# EAGLE design HG-Badge6 (EAGLE 8.2.0)
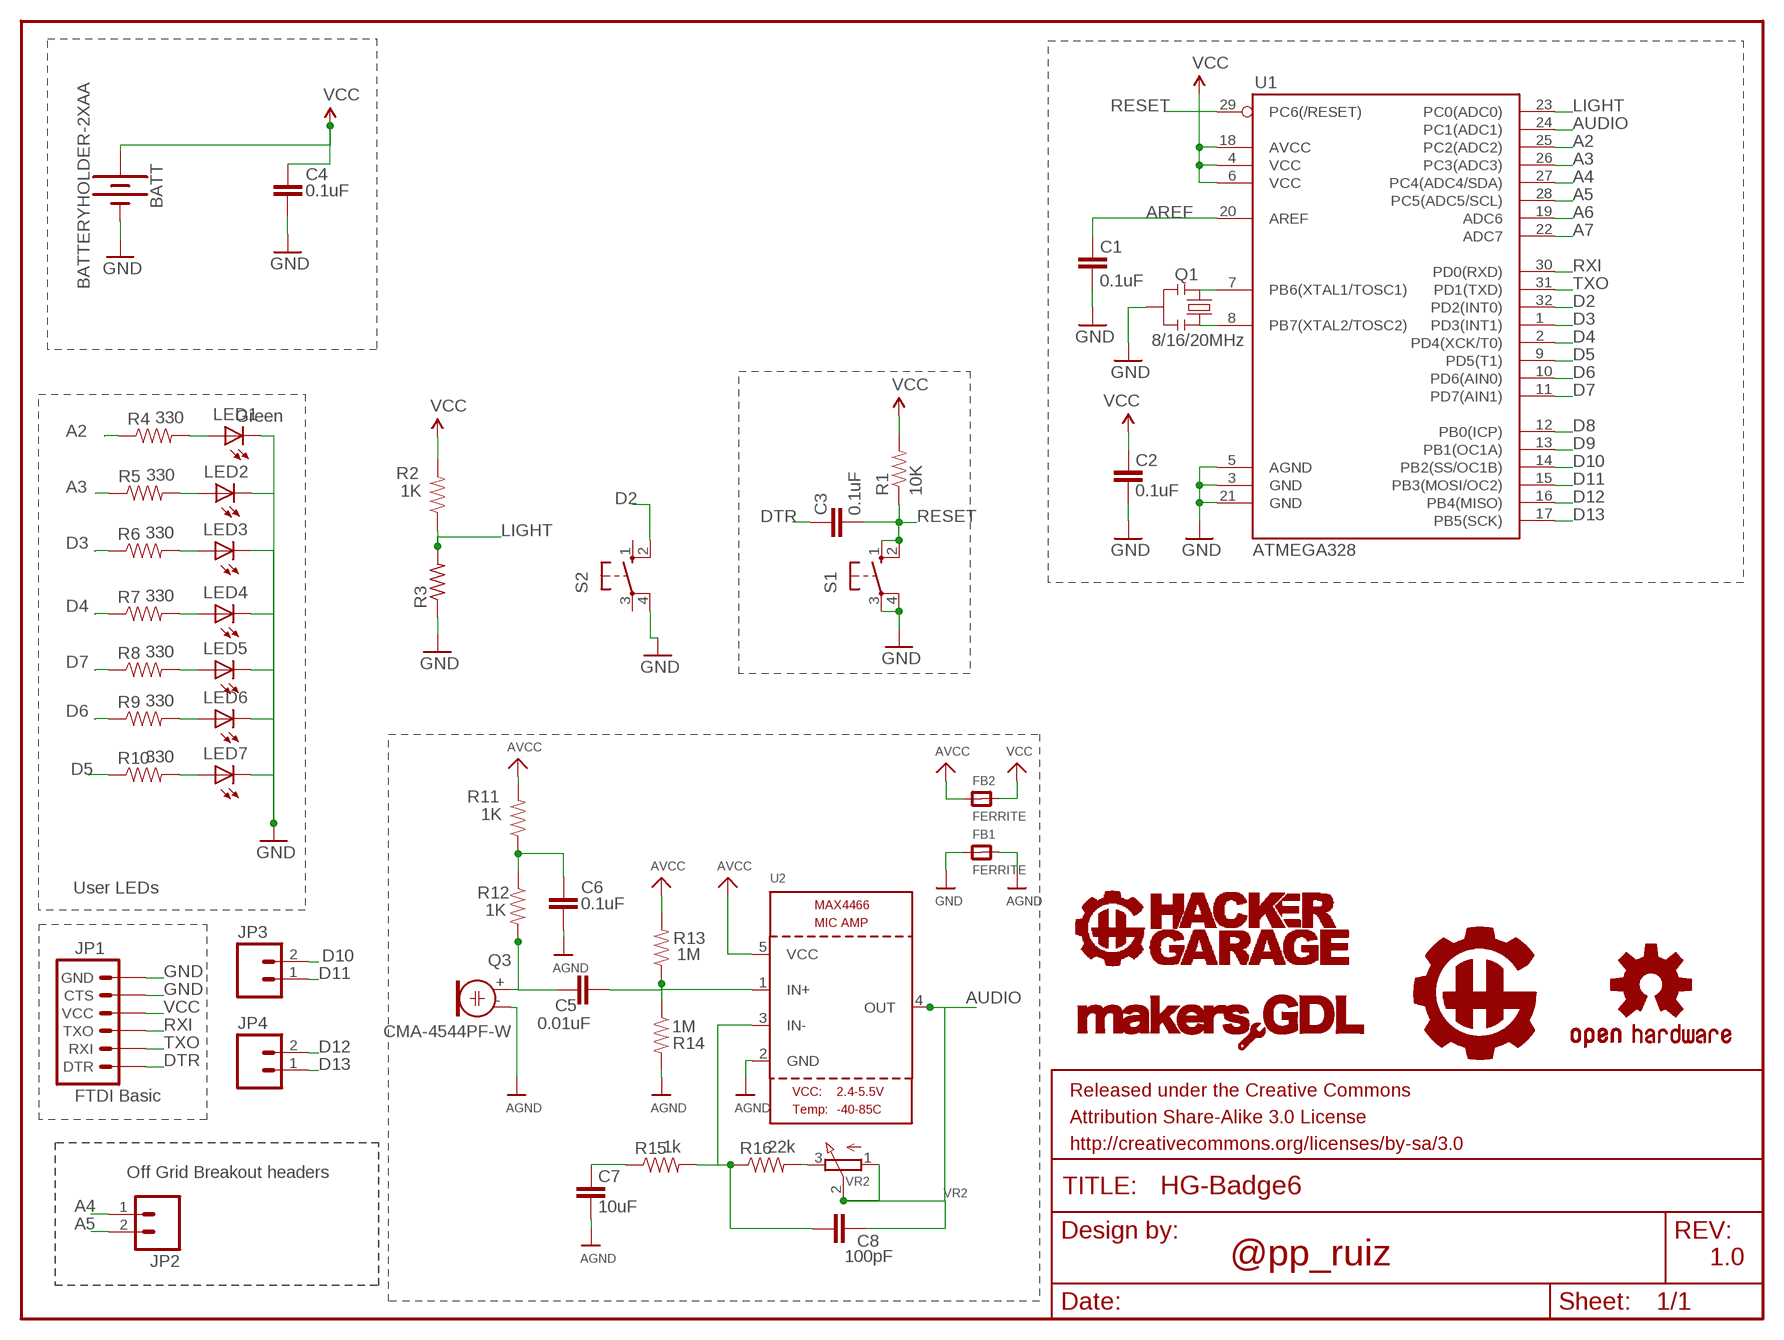
[diagram p0: schematic, sheet 1]

## Parts
BATT  BATTERYHOLDER-2XAA  [BATT-HOLDER-2XAAA]
C1  0.1uF  CAP0603-CAP  [0603-CAP]
C2  0.1uF  CAP0603-CAP  [0603-CAP]
C3  0.1uF  CAP0603-CAP  [0603-CAP]
C4  0.1uF  CAP0603-CAP  [0603-CAP]
C5  0.01uF  CAP0603-CAP  [0603-CAP]
C6  0.1uF  CAP0603-CAP  [0603-CAP]
C7  10uF  CAP0603-CAP  [0603-CAP]
C8  100pF  CAP0603-CAP  [0603-CAP]
FB1  FERRITE  FERRITE0805  [0805]
FB2  FERRITE  FERRITE0805  [0805]
FRAME1  FRAME-LETTER  [CREATIVE_COMMONS]
JP1  FTDI Basic  ARDUINO_SERIAL_PROGRAMPTH  [1X06]
JP2  M02PTH  [1X02]
JP3  M02PTH  [1X02]
JP4  M02PTH  [1X02]
LED1  Green  LED  [0603-LED-ALT1]
LED2  Green  LED  [0603-LED-ALT1]
LED3  Green  LED  [0603-LED-ALT1]
LED4  Green  LED  [0603-LED-ALT1]
LED5  Green  LED  [0603-LED-ALT1]
LED6  Green  LED  [0603-LED-ALT1]
LED7  Green  LED  [0603-LED-ALT1]
Q1  8/16/20MHz  RESONATOR1:1  [RESONATOR-SMD-1:1]
Q3  CMA-4544PF-W  ELECTRET  [ELECTRET_9.7]
R1  10K  RESISTOR0603-RES  [0603-RES]
R2  1K  RESISTOR0603-RES  [0603-RES]
R3  R-US_0204/2V  [0204V]
R4  330  RESISTOR0603-RES  [0603-RES]
R5  330  RESISTOR0603-RES  [0603-RES]
R6  330  RESISTOR0603-RES  [0603-RES]
R7  330  RESISTOR0603-RES  [0603-RES]
R8  330  RESISTOR0603-RES  [0603-RES]
R9  330  RESISTOR0603-RES  [0603-RES]
R10  330  RESISTOR0603-RES  [0603-RES]
R11  1K  RESISTOR0603-RES  [0603-RES]
R12  1K  RESISTOR0603-RES  [0603-RES]
R13  1M  RESISTOR0603-RES  [0603-RES]
R14  1M  RESISTOR0603-RES  [0603-RES]
R15  1k  RESISTOR0603-RES  [0603-RES]
R16  22k  RESISTOR0603-RES  [0603-RES]
S1  10-XX  [B3F-10XX]
S2  10-XX  [B3F-10XX]
U1  ATMEGA328  ATMEGA168  [TQFP32-08]
U2  MAX4466EXK+T  MAX4466""  [SC70-5]
U$1  HG-BADGE-FULL  [HG-BADGE]
U$3  OSHW-LOGOS  [OSHW-LOGO-S]
U$4  MAKERSGDLLOGO-SMALL  [MAKERSGGL-SMALL]
U$5  HACKERGARAGEFULL  [HACKERGARAGEFULL-SMALL]
VR2  VR2  TRIMPOTTC33X-2  [TRIMPOT_BOURNS_TC33X-2]

## Nets
A2: R4.1 U1.25(PC2(ADC2))
A3: R5.1 U1.26(PC3(ADC3))
A4: JP2.1 U1.27(PC4(ADC4/SDA))
A5: JP2.2 U1.28(PC5(ADC5/SCL))
A6: U1.19(ADC6)
A7: U1.22(ADC7)
AGND: C6.1 C7.1 FB1.2 Q3.- R14.2 U2.2(GND)
AREF: C1.2 U1.20(AREF)
AUDIO: C8.1 U1.24(PC1(ADC1)) U2.4(OUT) VR2.1(A) VR2.2(S)
AVCC: FB2.1 R11.2 R13.2 U2.5(VCC)
D2: S2.2(S1) U1.32(PD2(INT0))
D3: R6.1 U1.1(PD3(INT1))
D4: R7.1 U1.2(PD4(XCK/T0))
D5: R10.1 U1.9(PD5(T1))
D6: R9.1 U1.10(PD6(AIN0))
D7: R8.1 U1.11(PD7(AIN1))
D8: U1.12(PB0(ICP))
D9: U1.13(PB1(OC1A))
D10: JP3.2 U1.14(PB2(SS/OC1B))
D11: JP3.1 U1.15(PB3(MOSI/OC2))
D12: JP4.2 U1.16(PB4(MISO))
D13: JP4.1 U1.17(PB5(SCK))
DTR: C3.2 JP1.1(DTR)
GND: BATT.P$1(-) C1.1 C2.1 C4.1 FB1.1 JP1.5(CTS) JP1.6(GND) LED1.C LED2.C LED3.C LED4.C LED5.C LED6.C LED7.C Q1.2 R3.1 S1.3(P) S1.4(P1) S2.4(P1) U1.3(GND) U1.5(AGND) U1.21(GND)
LIGHT: R2.1 R3.2 U1.23(PC0(ADC0))
N$1: Q1.3 U1.8(PB7(XTAL2/TOSC2))
N$2: Q1.1 U1.7(PB6(XTAL1/TOSC1))
N$5: LED4.A R7.2
N$8: LED5.A R8.2
N$10: LED6.A R9.2
N$12: LED7.A R10.2
N$14: LED3.A R6.2
N$16: LED2.A R5.2
N$18: LED1.A R4.2
N$20: C8.2 R15.2 R16.1 U2.3(IN-)
N$21: C5.2 Q3.+ R12.2
N$22: C6.2 R11.1 R12.1
N$23: C5.1 R13.1 R14.1 U2.1(IN+)
N$24: R16.2 VR2.3(E)
N$25: C7.2 R15.1
RESET: C3.1 R1.1 S1.1(S) S1.2(S1) U1.29(PC6(/RESET))
RXI: JP1.3(TXO) U1.30(PD0(RXD))
TXO: JP1.2(RXI) U1.31(PD1(TXD))
VCC: BATT.P$2(+) C2.2 C4.2 FB2.2 JP1.4(VCC) R1.2 R2.2 U1.4(VCC) U1.6(VCC) U1.18(AVCC)
Unconnected: S2.1(S) S2.3(P)

## Notes on the sheet
- User LEDs
- Off Grid Breakout headers
- @pp_ruiz | 1.0

## Library data of the parts
BATT = StarlightMX:BATTERYHOLDER-2XAA
C1-C8 = SparkFun:CAP: Capacitor Standard 0603 ceramic capacitor, and 0.1" leaded capacitor.
FB1 FB2 = microbuilder:FERRITE: Ferrite Bead 0603 MMZ1608B121C - 120 Ohm @ 100MHz, 600mA, 0.15 Ohm DC Resistance - Digikey: 445-2164-1-ND BK1608HW121-T - 120 Ohm, 600mA Ferrite Chip - Digikey: 587-1876-2-ND 0805 HZ0805B272R-10 - 2.7K Ohm @ 100MHz, 200mA, 0.8 Ohm DC Resistance - Digikey: 240-2504-1-ND (see also Murata BLM21BD272SN1L) MMZ2012Y152B - 1.5K Ohm @ 100MHz, 500mA, 0.4 Ohm DC Resistance - Digikey: 445-1560-1-ND - Mainly for high frequency (80-400MHz) MMZ2012R102A - 1K Ohm @ 100MHz, 500mA, 0.3 Ohm DC Resistance - Digikey: 445-1555-2-ND - More general purpose (10-200MHz)
FRAME1 = SparkFun-Aesthetics:FRAME-LETTER: Schematic Frame Standard 8.5x11 US Letter frame
JP1 = SparkFun:ARDUINO_SERIAL_PROGRAM
JP2-JP4 = SparkFun:M02: Header 2 Standard 2-pin 0.1" header. Use with straight break away headers (SKU : PRT-00116), right angle break away headers (PRT-00553), swiss pins (PRT-00743), machine pins (PRT-00117), and female headers (PRT-00115). Molex polarized connector foot print use with SKU : PRT-08233 with associated crimp pins and housings.
LED1-LED7 = Testing:LED: LEDs Standard schematic elements and footprints for 5mm, 3mm, 1206, and 0603 sized LEDs. 5mm - Spark Fun Electronics SKU : COM-00529 (and others)
Q1 = Testing:RESONATOR: Resonator Small SMD resonator. This is the itty bitty 10/20MHz resonators with built in caps. CSTCE10M0G55 and CSTCE20M0V53. Footprint for SMD has been used in SFE production for years, and does work okay. 1:1 is an attempt to get larger fillets on the sides so it will be easier to inspect these solders in our AOI machine. The pads have been minimized to match the actual metal under the resonator. To see this relation, it includes an image import of the bottom side of the component. Imported to scale on layer 200.
Q3 = microbuilder:ELECTRET: Electret microphone Thru hole 2.54mm spacing with 9.7mm diameter
R1 R2 R4-R16 = SparkFun:RESISTOR: Resistor Basic schematic elements and footprints for 0603, 1206, and PTH resistors.
R3 = adafruit:R-US_: RESISTOR, American symbol
S1 S2 = switch-omron:10-XX: OMRON SWITCH; MPN: B3F-1000; OC_FARNELL: 176432; OC_NEWARK: 36M3542
U1 = SparkFun:ATMEGA168
U2 = microbuilder:MAX4466: MAX4466 - Microphone Pre-Amp
U$1 = StarlightMX:HG-BADGE-FULL
U$3 = SparkFun:OSHW-LOGO: Open Source Hardware Logo This logo indicates the piece of hardware it is found on incorporates a OSHW license and/or adheres to the definition of open source hardware found here: http://freedomdefined.org/OSHW
U$4 = StarlightMX:MAKERSGDLLOGO-SMALL
U$5 = StarlightMX:HACKERGARAGEFULL
VR2 = microbuilder:TRIMPOT: 3-Pin SMT Trimpots Bourns TC33 (X-2) Series 10K - Digikey: TC33X-2-103E 100K - Digikey: TC33X-104ECT-ND Bourns 3303 (W) Series 3mm 10K Single Turn - Digikey: 3303W-103ETR-ND 3mm 100K Single Turn - Digikey: 3303X-104ETR-ND

## Net classes
1 vcc: width 0.254 mm

## Board
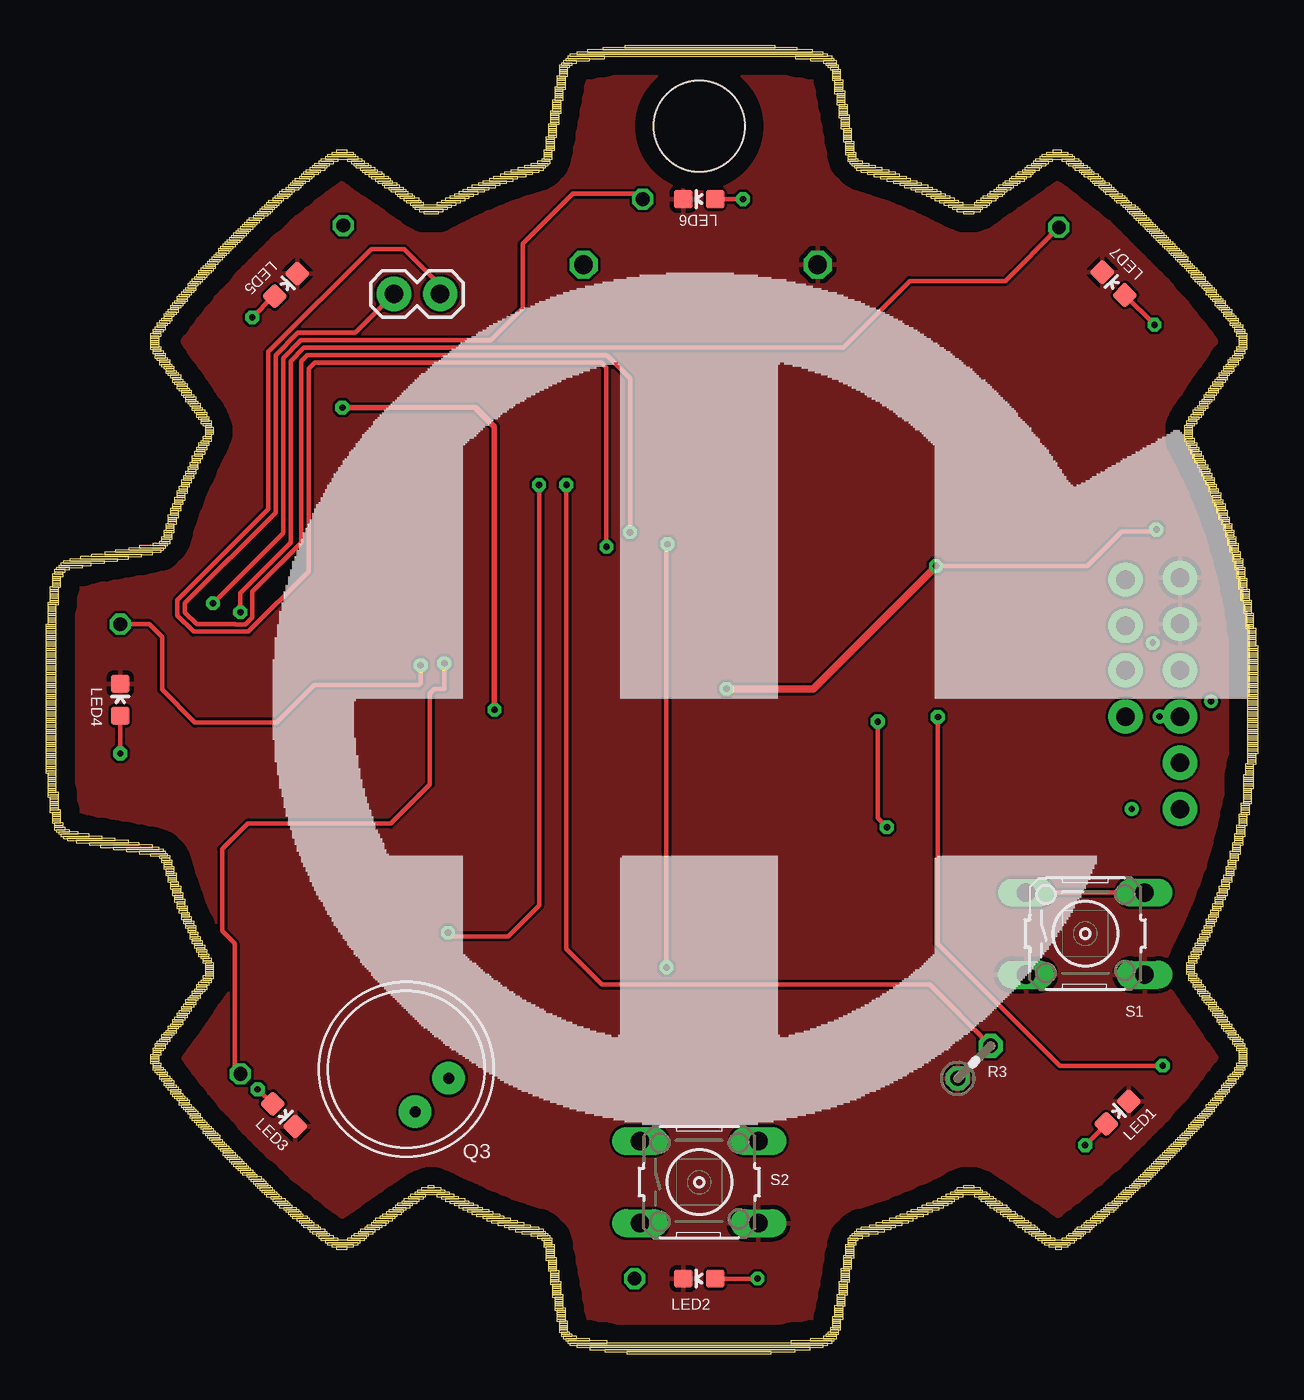
[diagram p1: board, top side]
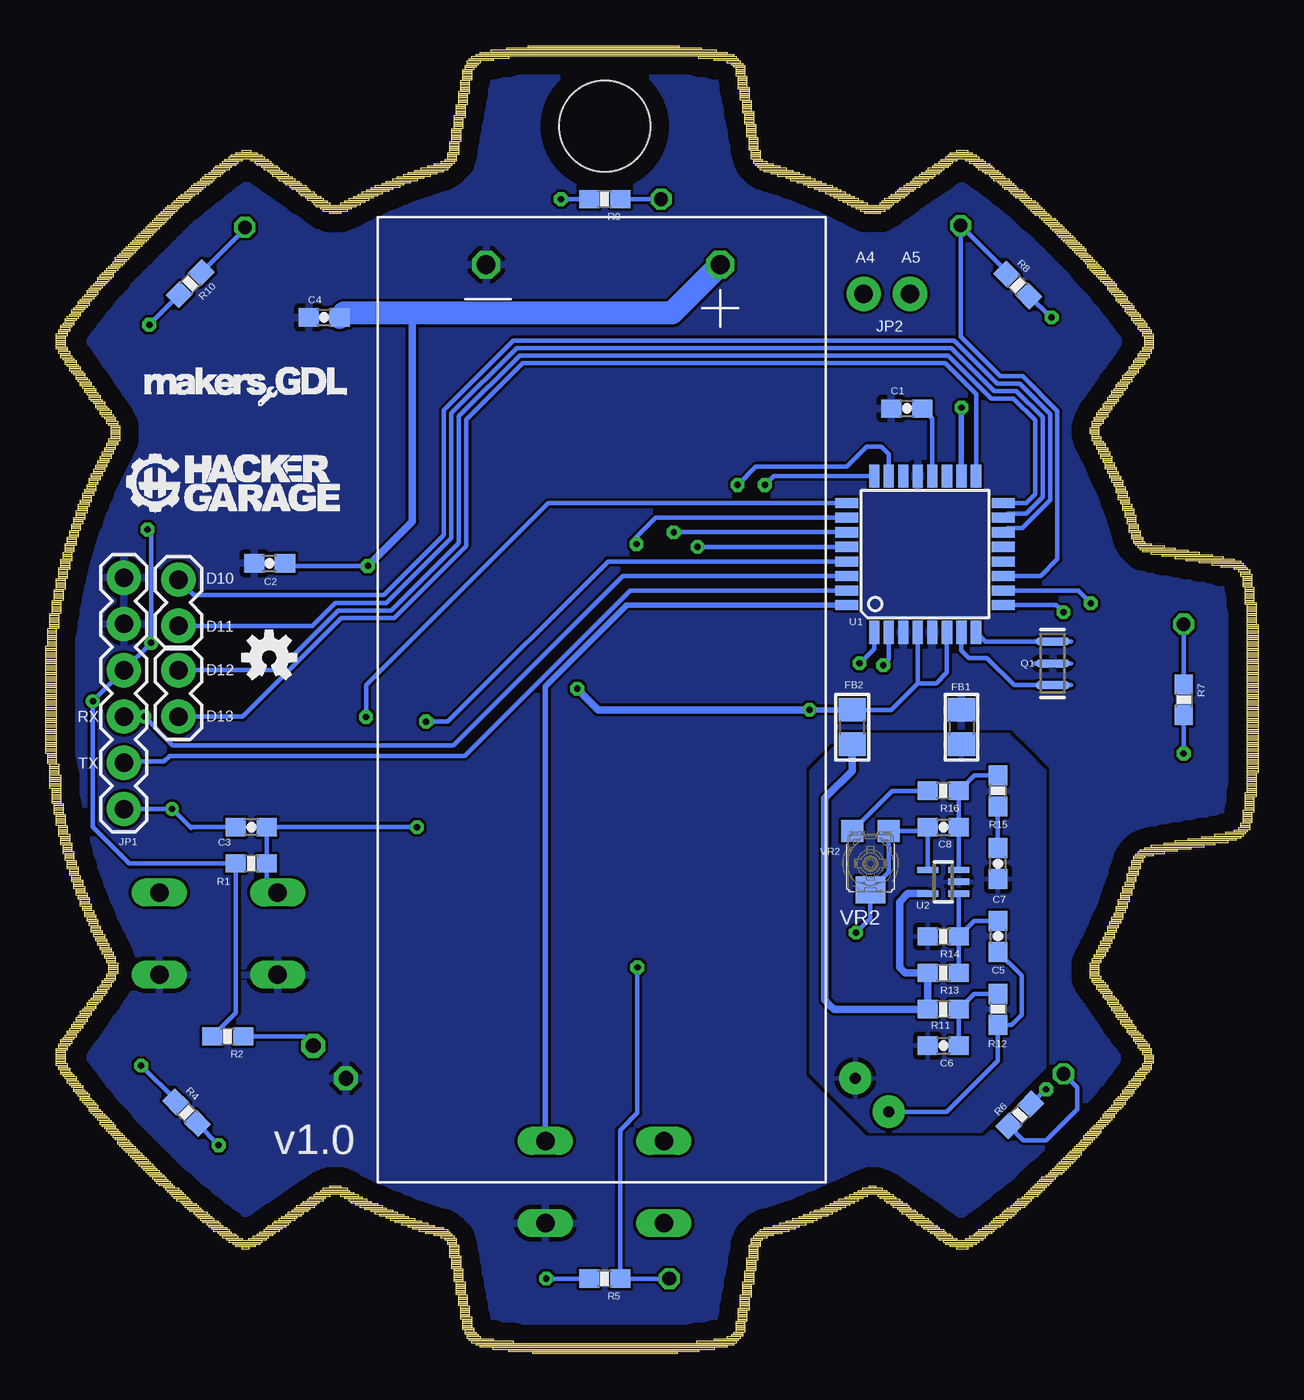
[diagram p2: board, bottom side, seen from below]

Size 66.6 x 71.88 mm. Coordinates in mm from the lower left corner, seen from the top.
Copper layers (1*16): Top 0.035mm / dielectric 1.5mm / Bottom 0.035mm
Design rules "default": minimum track width 6mil, minimum drill 0.35mm, track to track 6mil, track to pad 6mil, pad to pad 6mil, via to via 6mil, smd to smd 6mil, copper to edge 40mil, drill to drill 6mil, minimum pad ring 10mil, minimum via ring 8mil, stop-mask expansion 4mil, vias tented up to drill 0mil, thermal gap 10mil
Holes 5 mm at 35.9,67.44

### Footprints (pad centres in the part's own frame; a part is rotated, then mirrored left to right if it is on the bottom)
BATT-HOLDER-2XAAA = drill 1.02 octagon: P$1 -6.35,23.9; P$2 6.5,23.9
0603-CAP = smd 1.1 x 1: 1 -0.85,0; 2 0.85,0
0805 = smd 1.3 x 1.5: 1 -0.95,0; 2 0.95,0
1X06 = drill 1.016 pad 1.88: 1 0,0; 2 2.54,0; 3 5.08,0; 4 7.62,0; 5 10.16,0; 6 12.7,0
1X02 = drill 1.016 pad 1.88: 1 0,0; 2 2.54,0
0603-LED-ALT1 = smd 1 x 1: A 0,-0.877; C 0,0.877
RESONATOR-SMD-1:1 = smd 0.45 x 1.905: 1 -1.2,0; 2 0,0; 3 1.2,0
ELECTRET_9.7 = drill 0.6 pad 1.778: + 1.3,2; - -1.3,2
0603-RES = smd 1.1 x 1: 1 -0.85,0; 2 0.85,0
0204V = drill 0.813 octagon: 1 -1.27,0; 2 1.27,0
B3F-10XX = drill 1.016 long: 1 -3.251,2.261; 2 3.251,2.261; 3 -3.251,-2.261; 4 3.251,-2.261
TQFP32-08 = smd 1.27 x 0.559: 1 -4.293,2.8; 2 -4.293,2; 3 -4.293,1.2; 4 -4.293,0.4; 5 -4.293,-0.4; 6 -4.293,-1.2; 7 -4.293,-2; 8 -4.293,-2.8; 17 4.293,-2.8; 18 4.293,-2; 19 4.293,-1.2; 20 4.293,-0.4; 21 4.293,0.4; 22 4.293,1.2; 23 4.293,2; 24 4.293,2.8 | smd 0.559 x 1.27: 9 -2.8,-4.293; 10 -2,-4.293; 11 -1.2,-4.293; 12 -0.4,-4.293; 13 0.4,-4.293; 14 1.2,-4.293; 15 2,-4.293; 16 2.8,-4.293; 25 2.8,4.293; 26 2,4.293; 27 1.2,4.293; 28 0.4,4.293; 29 -0.4,4.293; 30 -1.2,4.293; 31 -2,4.293; 32 -2.8,4.293
SC70-5 = smd 0.35 x 1.15: 1 -0.65,-0.85; 2 0,-0.85; 3 0.65,-0.85; 4 0.65,0.85; 5 -0.65,0.85
TRIMPOT_BOURNS_TC33X-2 = smd 1.2 x 1.2: 1 -1,-1.8; 3 1,-1.8 | smd 1.6 x 1.5: 2 0,1.45

### Placement (x,y rotation side)
BATT  36.05,35.94 0 bottom
C1  19.3,51.94 0 bottom
C2  54.3,43.44 0 bottom
C3  55.3,28.94 180 bottom
C4  51.3,56.94 0 bottom
C5  14.3,22.94 270 bottom
C6  17.3,16.94 0 bottom
C7  14.3,26.94 90 bottom
C8  17.3,28.94 0 bottom
FB1  16.3,34.44 270 bottom
FB2  22.3,34.44 90 bottom
FRAME1  77.56,12.64 0 top  (outside the outline)
JP1  62.3,29.94 90 bottom
JP2  19.13,58.23 0 top
JP3  59.3,40 90 bottom
JP4  59.3,35.02 90 bottom
LED1  58.86,13.26 315 top
LED2  35.9,4.14 90 top
LED3  13.1,13.13 225 top
LED4  4.1,35.94 0 top
LED5  13.21,58.72 315 top
LED6  35.9,63.44 90 top
LED7  58.65,58.8 45 top
Q1  11.3,37.94 90 bottom
Q3  19.8,15.64 225 top
R1  55.3,26.94 180 bottom
R2  56.6,17.44 180 bottom
R3  51,16.04 45 top
R4  58.86,13.26 315 bottom
R5  35.9,4.14 180 bottom
R6  13.1,13.13 45 bottom
R7  4.1,35.94 270 bottom
R8  13.21,58.72 315 bottom
R9  35.9,63.44 180 bottom
R10  58.65,58.8 225 bottom
R11  17.3,18.94 180 bottom
R12  14.3,18.94 270 bottom
R13  17.3,20.94 180 bottom
R14  17.3,22.94 180 bottom
R15  14.3,30.94 90 bottom
R16  17.3,30.94 180 bottom
S1  57.1,23.09 0 top
S2  35.9,9.44 0 top
U1  18.3,43.94 90 bottom
U2  17.3,25.94 90 bottom
U$1  -2.7,-3.06 0 top  (outside the outline)
U$3  54.32,38.26 0 bottom
U$4  56.02,53.28 0 bottom
U$5  56.18,47.69 0 bottom
VR2  21.3,26.94 180 bottom

### Tracks (layer width: path | path; a pad name or v marks a point on that pad's centre or on a via)
A2  (via drill 0.35)
  Top 0.254: v61.35,15.84 55.7,15.84 49,22.54 49,34.94 48.95,34.99 v49,34.99
  Bottom 0.254: U1.25 39,46.74 49,36.74 v49,34.99 | R4.1 59.46,13.95 v61.35,15.84
A3  (via drill 0.35, 0.75)
  Top 0.254: v34.15,44.49 34.1,44.44 v34.1,21.24
  Bottom 0.254: U1.26 33.1,45.94 34.15,44.89 v34.15,44.49 | 32.38,4.16 v32.35,4.14 R5.1 35.05,12.29 34.1,13.24 v34.1,21.24
A4  (via drill 0.35)
  Top 0.254: v32.1,45.14 32.1,52.89 32.1,53.59 30.81,54.88 14.36,54.88 14.04,54.55 14.04,44.57 11.36,41.89 11.36,40.47 10.97,40.08 10.43,40.08 10.42,40.09 8.3,40.09 7.65,40.74 7.65,41.24 12.64,46.23 12.64,54.88 13.86,56.1 17,56.1 JP2.1
  Bottom 0.254: U1.27 v32.1,45.14 | v32.1,45.14 32.15,45.19 v32.1,45.14
A5  (via drill 0.35)
  Top 0.254: JP2.2 21.67,58.72 19.7,60.69 17.88,60.69 12.24,55.05 12.24,46.4 7.24,41.41 7.24,40.57 8.14,39.68 11.14,39.68 14.44,42.98 14.44,54.14 14.78,54.47 30.52,54.47 30.8,54.19 v30.8,44.34
  Bottom 0.254: U1.28 v30.8,44.34
AGND
  pour Bottom: 16.8,34.04 22.6,34.04 24.6,32.04 24.6,15.44 21.4,12.24 15.2,12.24 11.7,15.74 11.7,32.04 12.8,33.14 13.7,34.04
AREF
  Bottom 0.254: U1.20 17.9,51.39 C1.2
AUDIO  (via drill 0.35)
  Top 0.254: v27.1,47.74 27.1,24.64 25.4,22.94 22.3,22.94 v22.1,23.14
  Bottom 0.254: U2.4 C8.1 18.53,28.74 VR2.1 20.3,26.49 VR2.2 21.3,23.94 v22.1,23.14 | U1.24 26.61,48.23 v27.1,47.74
AVCC
  Bottom 0.406: FB2.1 22.3,32.04 23.8,30.54 23.8,19.44 23.55,19.19 | 23.55,19.19 23.3,18.94 | 23.3,18.94 R11.2 R13.2 19.4,20.94 19.7,21.24 19.7,24.84 19.25,25.29 U2.5 | 23.3,18.94 23.55,19.19
D2
  Bottom 0.305: U1.32 34.69,41.14 39.15,36.68 S2.2
D3  (via drill 0.35, 0.75)
  Top 0.254: v21.9,37.94 21.9,36.54 21.35,36.54 21.1,36.29 21.1,31.29 18.95,29.14 11.1,29.14 9.7,27.74 9.7,23.24 10.38,22.55 10.38,15.71 v10.7,15.39
  Bottom 0.254: U1.1 21.1,38.74 v21.9,37.94 | v10.7,15.39 9.95,14.64 9.95,13.44 11.65,11.74 12.9,11.74 13.69,12.53 R6.1
D4  (via drill 0.35, 0.75)
  Top 0.254: v20.6,37.84 20.6,36.84 20.51,36.75 14.76,36.75 12.7,34.69 8.2,34.69 6.4,36.49 6.4,39.39 5.7,40.09 v4.1,40.09
  Bottom 0.254: U1.2 20.3,38.14 v20.6,37.84 | R7.1 v4.1,40.09
D5  (via drill 0.35, 0.75)
  Top 0.254: v55.65,61.89 52.7,58.94 47.45,58.94 43.79,55.28 14.19,55.28 13.46,54.55 13.46,44.57 10.7,41.81 v10.7,40.74
  Bottom 0.254: U1.9 11.1,41.14 v10.7,40.74 | v55.65,61.89 55.65,61.8 R10.1
D6  (via drill 0.35, 0.75)
  Top 0.254: 9.4,41.44 v9.2,41.24 13.05,45.09 13.05,54.71 14.03,55.69 24.45,55.69 26.2,57.44 26.2,60.99 28.95,63.74 32.5,63.74 v32.8,63.44
  Bottom 0.254: U1.10 9.9,41.94 v9.2,41.24 | R9.1 v32.8,63.44
D7  (via drill 0.75)
  Bottom 0.254: U1.11 11.95,42.74 11.03,43.66 11.03,51.79 12.95,53.71 14.17,53.71 16.35,55.89 v16.35,61.99 13.81,59.45 R8.1
D10
  Bottom 0.254: U1.14 13.77,45.38 12.96,45.38 11.44,46.9 11.44,51.63 13.11,53.3 14.34,53.3 16.7,55.66 40.9,55.66 44.72,51.84 44.72,45 48.02,41.69 58.45,41.69 JP3.2
D11
  Bottom 0.254: U1.15 13.77,46.18 12.73,46.18 11.84,47.07 11.84,51.46 13.28,52.9 14.51,52.9 16.86,55.25 40.74,55.25 44.31,51.68 44.31,44.83 47.89,41.25 50.69,41.25 51.94,40 JP3.1
D12
  Bottom 0.254: U1.16 12.75,46.74 12.25,47.24 12.25,51.29 13.45,52.49 14.68,52.49 17.03,54.85 40.57,54.85 43.91,51.51 43.91,44.56 47.62,40.85 50.52,40.85 53.8,37.56 JP4.2
D13
  Bottom 0.254: U1.17 15.5,52.74 17.2,54.44 40.4,54.44 43.5,51.34 43.5,44.39 47.45,40.44 50.35,40.44 55.77,35.02 JP4.1
DTR  (via drill 0.35)
  Bottom 0.254: 62.25,29.89 JP1.1 v59.65,29.94 58.6,28.89 58.55,28.94 C3.2
GND
  pour Top: 12.7,72.44 53.1,72.44 71.7,53.84 71.7,19.74 51,-0.96 18.6,-0.96 -1.9,19.54 -1.9,57.84
  pour Bottom (rank 3): 14.2,72.64 52.7,72.64 69.2,56.14 69.2,14.44 53.89,-1.07 17.09,-1.07 -2.3,19.34 -2.3,56.14
LIGHT  (via drill 0.35)
  Top 0.254: v28.6,47.74 28.6,22.24 30.55,20.29 48.55,20.29 R3.2
  Bottom 0.254: U1.23 20.3,49.44 20.7,49.84 21.5,49.84 22.6,48.74 27.6,48.74 v28.6,47.74 | 51.85,16.99 R3.2 52.4,17.44 R2.1
N$1
  Bottom 0.254: Q1.3 14.99,39.14 U1.8
N$2
  Bottom 0.254: Q1.1 13.4,36.74 14.9,38.24 15.9,38.24 16.3,38.64 U1.7
N$5  (via drill 0.35)
  Top 0.254: v4.1,32.99 LED4.A
  Bottom 0.254: R7.2 v4.1,32.99
N$8  (via drill 0.35)
  Top 0.254: LED5.A 12.51,58.1 v11.35,56.94
  Bottom 0.254: R8.2 v11.35,56.94
N$10  (via drill 0.35)
  Top 0.254: v38.3,63.44 LED6.A
  Bottom 0.254: R9.2 v38.3,63.44
N$12  (via drill 0.35)
  Top 0.254: v60.9,56.54 LED7.A
  Bottom 0.254: R10.2 60.65,56.8 60.65,56.79 v60.9,56.54
N$14  (via drill 0.35)
  Top 0.254: LED3.A v11.65,14.54
  Bottom 0.254: R6.2 v11.65,14.54
N$16  (via drill 0.35)
  Top 0.254: LED2.A v39.1,4.14
  Bottom 0.254: R5.2 v39.1,4.14
N$18  (via drill 0.35)
  Top 0.254: LED1.A 58.24,12.62 v57.09,11.47
  Bottom 0.254: v57.09,11.47 R4.2
N$20
  Bottom 0.254: U2.3 C8.2 R16.1 15.6,31.79 R15.2
N$21
  Bottom 0.254: C5.2 13,20.79 13,18.64 13.55,18.09 R12.2 14.3,16.11 17.11,13.31 Q3.+
N$22
  Bottom 0.254: R12.1 15.6,19.79 R11.1 C6.2
N$23
  Bottom 0.254: R14.1 R13.1 | C5.1 15.6,23.79 R14.1 | U2.1 R14.1
N$24
  Bottom 0.254: R16.2 20.1,30.94 VR2.3
N$25
  Bottom 0.254: C7.2 R15.1
RESET  (via drill 0.35)
  Top 0.254: v45.7,34.74 45.7,29.44 v46.2,28.94 | S1.1 S1.2
  Bottom 0.254: U1.29 35.7,43.54 44.5,34.74 v45.7,34.74 | v46.2,28.94 C3.1 R1.1 54.45,25.95 S1.1
RXI  (via drill 0.35)
  Bottom 0.254: U1.30 34.9,42.74 44.2,33.44 59.6,33.44 v61.18,35.02 JP1.3
TXO  (via drill 0.35)
  Bottom 0.254: U1.31 34.5,41.94 43.58,32.86 59.78,32.86 60.1,32.54 v62.24,32.54 JP1.2
VCC  (via drill 0.35)
  Top 0.254: v48.9,43.29 57.2,43.29 59.1,45.19 60.9,45.19 v61,45.29
  Top 0.305: v16.3,51.99 23.6,51.99 24.65,50.94 v24.65,35.39
  Top 0.406: v37.4,36.54 42.15,36.54 v48.9,43.29
  Bottom 0.254: 18.7,36.84 U1.4 | 18.7,36.84 20.15,35.39 FB2.2 | U1.6 17.1,37.44 17.7,36.84 18.7,36.84 | v61,45.29 arc90 60.8,45.09 v60.8,39.06 JP1.4 v64,35.86 64,28.94 62,26.94 R1.2 56.15,18.74 R2.2 | C2.2 53.3,43.29 v48.9,43.29
  Bottom 0.305: FB2.2 v24.65,35.39 | U1.18 v16.3,51.99
  Bottom 0.406: v24.65,35.39 36.25,35.39 v37.4,36.54 | v48.9,43.29 46.45,45.74 46.45,57.19
  Bottom 1.27: BATT.P$2 32.2,57.19 46.45,57.19 50.2,57.19 C4.2

### Text on the board
bNames: A5 | A4 | D10 | D11 | D12 | D13 | RX | TX | v1.0